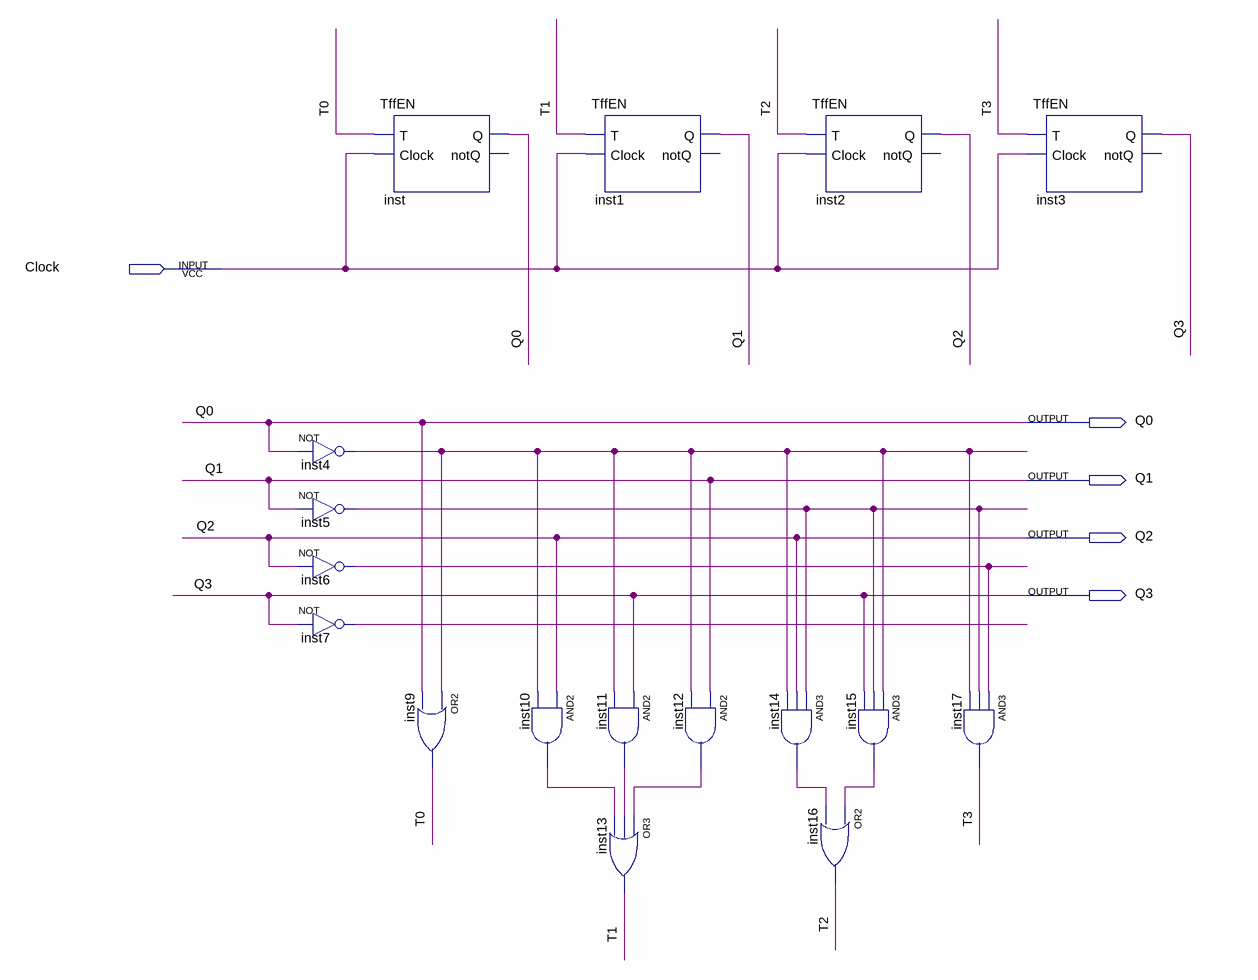
[diagram p0: schematic sheet]
// Quartus schematic BCDbackward.bdf as structural Verilog: 17 symbols, 5 pins
module BCDbackward (
  input  Clock,
  output Q0,
  output Q1,
  output Q2,
  output Q3
);

  wire inst4_out, inst5_out, inst6_out, inst7_out, inst10_out, inst11_out, inst12_out, inst14_out,
       inst15_out, T0, T1, T2, T3;

  not inst4 (inst4_out, Q0);
  not inst5 (inst5_out, Q1);
  not inst6 (inst6_out, Q2);
  not inst7 (inst7_out, Q3);
  TffEN inst (.T(T0), .Clock(Clock), .Q(Q0));  // open: notQ
  or inst9 (T0, inst4_out, Q0);
  and inst10 (inst10_out, Q2, inst4_out);
  TffEN inst1 (.T(T1), .Clock(Clock), .Q(Q1));  // open: notQ
  and inst11 (inst11_out, Q3, inst4_out);
  or inst13 (T1, inst12_out, inst11_out, inst10_out);
  and inst12 (inst12_out, Q1, inst4_out);
  and inst14 (inst14_out, inst5_out, Q2, inst4_out);
  TffEN inst2 (.T(T2), .Clock(Clock), .Q(Q2));  // open: notQ
  and inst15 (inst15_out, inst4_out, inst5_out, Q3);
  or inst16 (T2, inst15_out, inst14_out);
  and inst17 (T3, inst6_out, inst5_out, inst4_out);
  TffEN inst3 (.T(T3), .Clock(Clock), .Q(Q3));  // open: notQ
endmodule
